# Altium project G030-T12_v2.PrjPcb
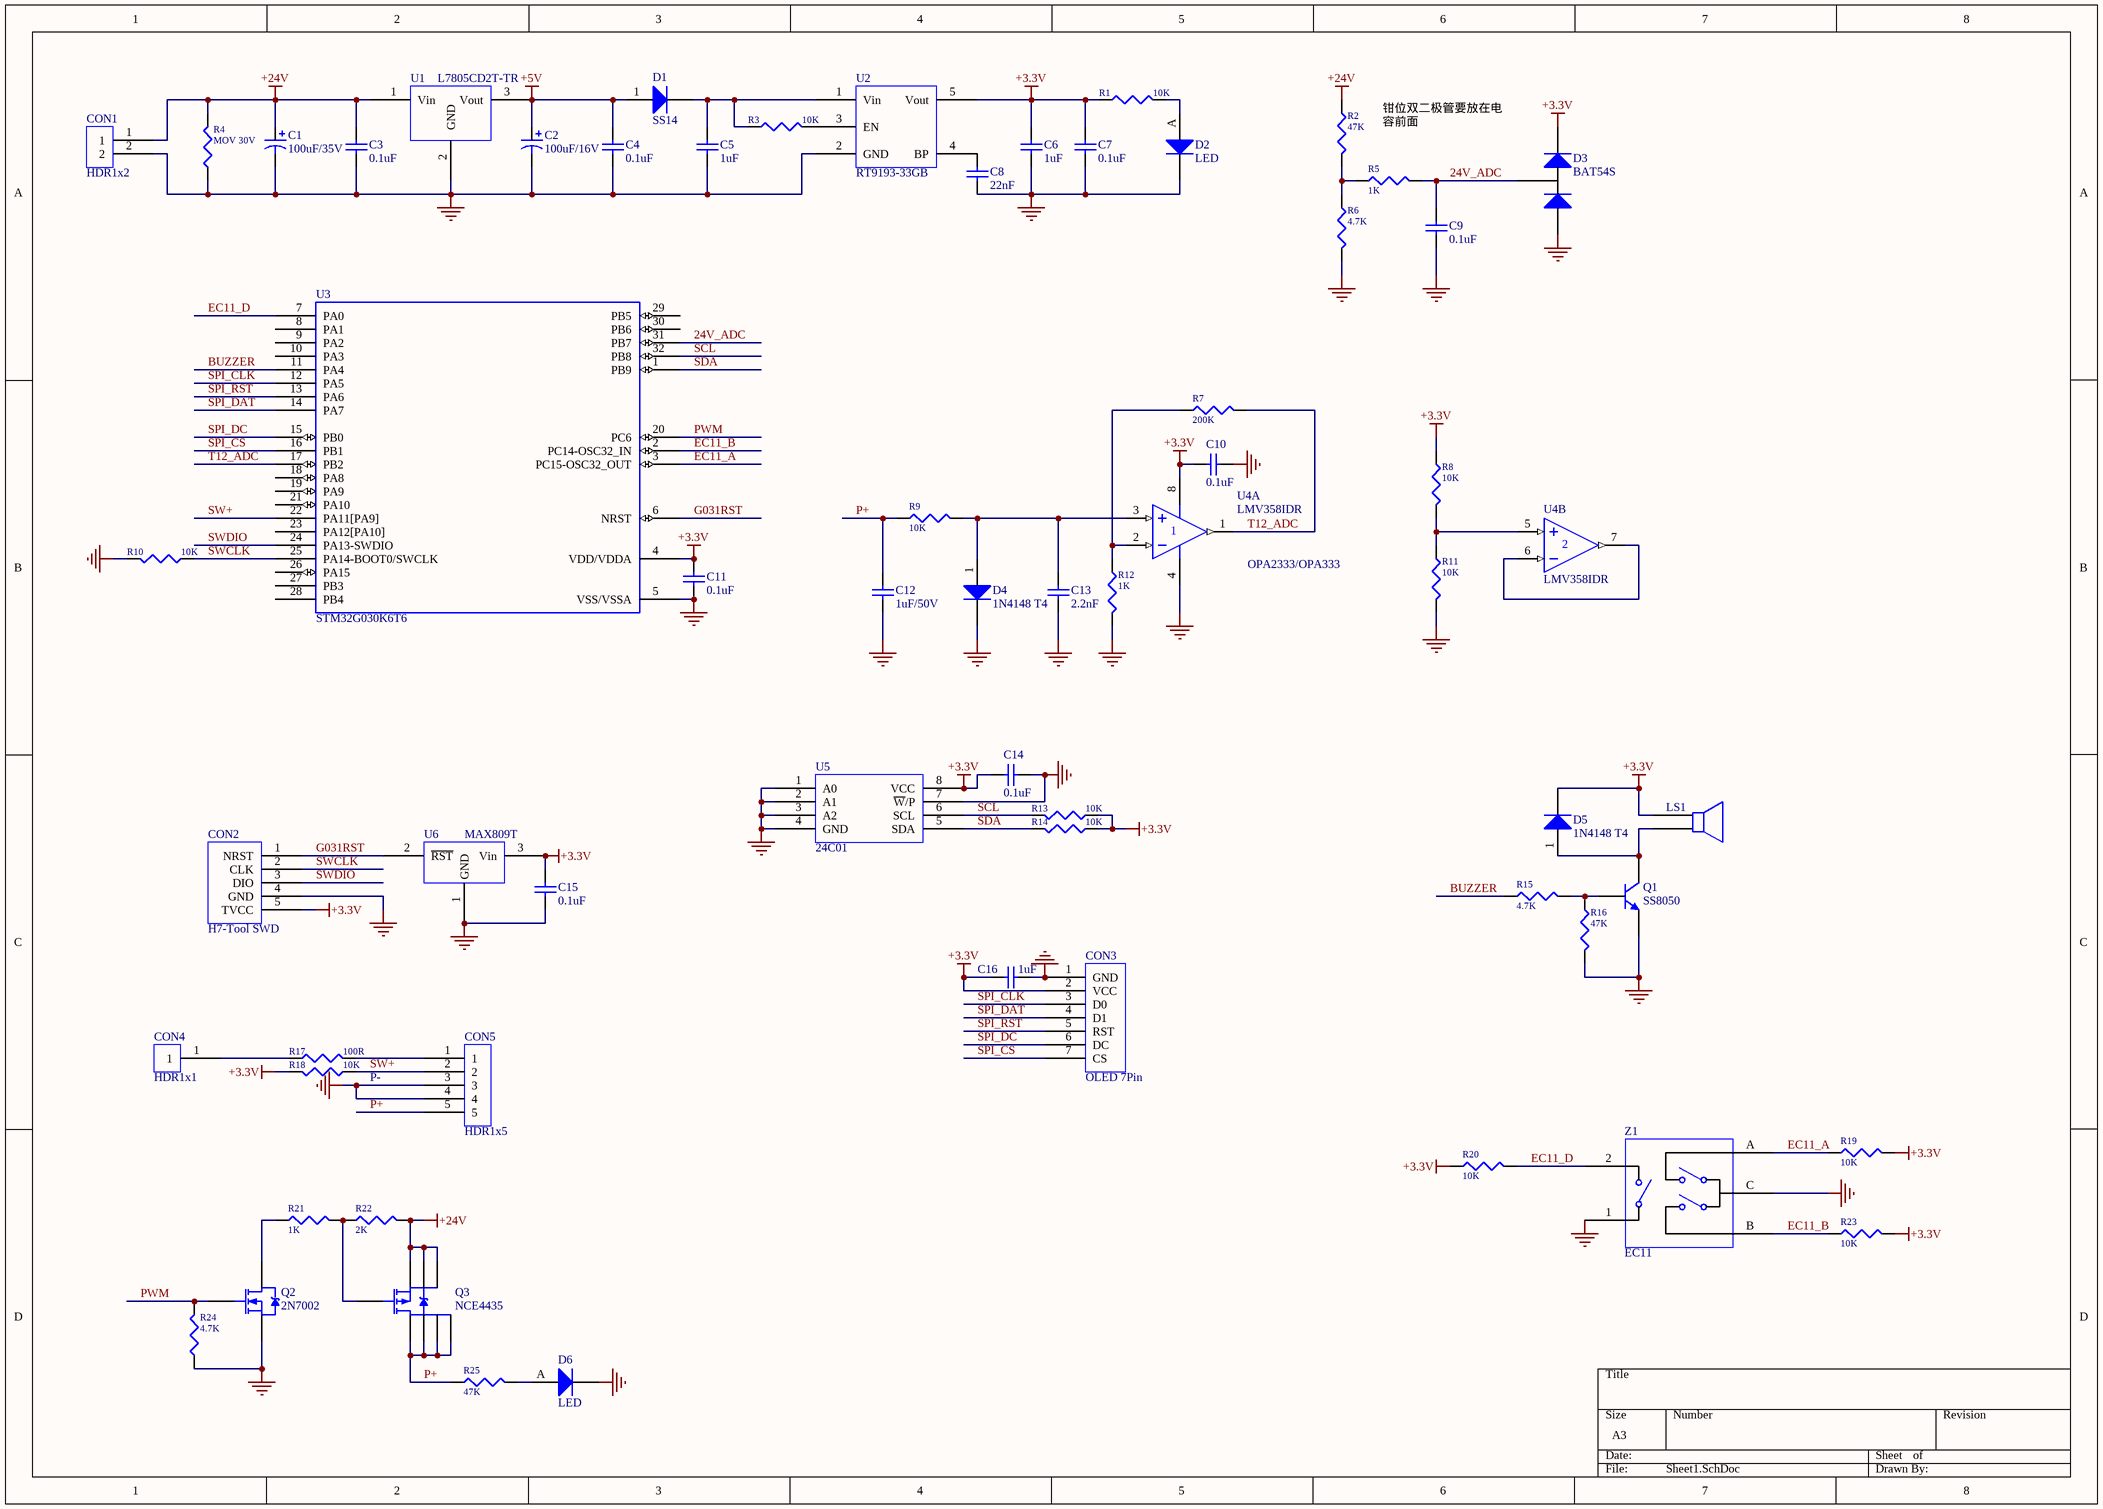
[diagram p0: Sheet1.SchDoc]
1 sheet, 63 parts. Net scope: global (net labels, ports and power ports of the same name join across sheets).
Board file: PCB1.PcbDoc

## Sheet Sheet1.SchDoc
size A3; SheetNumber: 1; SheetTotal: 1

### Parts
C1  value 100uF/35V  [CAP-SMD_BD6.3-L6.6-W6.6-FD]  (hidden comment: Cap Pol1)
C2  value 100uF/16V  [CAP-SMD_BD6.3-L6.6-W6.6-FD]  (hidden comment: Cap Pol1)
C3  0.1uF  [0603_C]
C4  0.1uF  [0603_C]
C5  1uF  [0603_C]
C6  1uF  [0603_C]
C7  0.1uF  [0603_C]
C8  22nF  [0603_C]
C9  0.1uF  [0603_C]
C10  0.1uF  [0603_C]
C11  0.1uF  [0603_C]
C12  1uF/50V  [0603_C]
C13  2.2nF  [0603_C]
C14  0.1uF  [0603_C]
C15  0.1uF  [0603_C]
C16  1uF  [0603_C]
CON1  HDR1x2  [HDR2.54-LI-2p]
CON2  H7-Tool SWD  [hdr1x5]
CON3  OLED 7Pin  [0.96 OLED SPI]
CON4  HDR1x1  [HDR2.54-LI-1P]
CON5  HDR1x5  [T12_SOCKET]
D1  SS14  [SMA(DO-214AC)_S1]
D2  LED  [0603_LED_S1]
D3  BAT54S  [SOT-23(SOT-23-3)]
D4  1N4148 T4  [SOD-123_MARK]
D5  1N4148 T4  [SOD-123_MARK]
D6  LED  [0603_LED_S1]
LS1  GSC8525RA-16R2700  [BUZ-SMD_L5.0-W5.5-P4.60]  (value not drawn)
Q1  SS8050  [SOT-23(SOT-23-3)]
Q2  2N7002  [SOT-23(SOT-23-3)]
Q3  NCE4435  [SOP-8_150mil]
R1  10K  [0603_R]
R2  47K  [0603_R]
R3  10K  [0603_R]
R4  MOV 30V  [0805_R]
R5  1K  [0603_R]
R6  4.7K  [0603_R]
R7  200K  [0603_R]
R8  10K  [0603_R]
R9  10K  [0603_R]
R10  10K  [0603_R]
R11  10K  [0603_R]
R12  1K  [0603_R]
R13  10K  [0603_R]
R14  10K  [0603_R]
R15  4.7K  [0603_R]
R16  47K  [0603_R]
R17  100R  [1206_R]
R18  10K  [0603_R]
R19  10K  [0603_R]
R20  10K  [0603_R]
R21  1K  [0603_R]
R22  2K  [0603_R]
R23  10K  [0603_R]
R24  4.7K  [0603_R]
R25  47K  [0603_R]
U1  L7805CD2T-TR  [TO-263-2]
U2  RT9193-33GB  [SOT-23-5]
U3  STM32G030K6T6  [LQFP-32_7x7x08P]
U4  LMV358IDR  [SOP-8_150mil]  (parts A,B of 2)
U5  24C01  [SOP-8_150mil]
U6  MAX809T  [SOT-23(SOT-23-3)]
Z1  EC11  [EC11-B]

### Nets
+3.3V: C6.2 C7.2 C10.1 C11.2 C14.2 C15.1 C16.1 CON2.5(TVCC) CON3.2(VCC) D3.2 D5.2(K) LS1.1 R1.2(BOT) R8.1(TOP) R13.1(TOP) R14.1(TOP) R18.2(BOT) R19.2(BOT) R20.1(TOP) R23.2(BOT) U2.5(Vout) U3.4(VDD/VDDA) U4.8 U5.8(VCC) U6.3(Vin)
+5V: C2.1 C4.2 D1.1(A) U1.3(Vout)
+24V: C1.1 C3.2 CON1.1 Q3.1(S) Q3.2(S) Q3.3(S) R2.1(TOP) R4.1(TOP) R22.2(BOT) U1.1(Vin)
GND: C1.2 C2.2 C3.1 C4.1 C5.1 C6.1 C7.1 C8.1 C9.1 C10.2 C11.1 C12.1 C13.1 C14.1 C15.2 C16.2 CON1.2 CON2.4(GND) CON3.1(GND) CON5.3 CON5.4 D2.K D3.1 D4.2(K) D6.K Q1.2(E) Q2.2(S) R4.2(BOT) R6.2(BOT) R10.2(BOT) R11.2(BOT) R12.2(BOT) R16.2(BOT) R24.1(TOP) U1.2(GND) U2.2(GND) U3.5(VSS/VSSA) U4.4 U5.1(A0) U5.2(A1) U5.3(A2) U5.4(GND) U5.7(~{W}/P) U6.1(GND) Z1.1(E) Z1.C
24V_ADC: C9.2 D3.3 R5.2(BOT) U3.31(PB7)
BUZZER: R15.1(TOP) U3.11(PA4)
EC11_A: R19.1(TOP) U3.3(PC15-OSC32_OUT) Z1.A
EC11_B: R23.1(TOP) U3.2(PC14-OSC32_IN) Z1.B
EC11_D: R20.2(BOT) U3.7(PA0) Z1.2(D)
G031RST: CON2.1(NRST) U3.6(NRST) U6.2(~{RST})
P+: C12.2 CON5.5 Q3.5(D) Q3.6(D) Q3.7(D) Q3.8(D) R9.1(TOP) R25.2(BOT)
PWM: Q2.1(G) R24.2(BOT) U3.20(PC6)
SCL: R13.2(BOT) U3.32(PB8) U5.6(SCL)
SDA: R14.2(BOT) U3.1(PB9) U5.5(SDA)
SPI_CLK: CON3.3(D0) U3.12(PA5)
SPI_CS: CON3.7(CS) U3.16(PB1)
SPI_DAT: CON3.4(D1) U3.14(PA7)
SPI_DC: CON3.6(DC) U3.15(PB0)
SPI_RST: CON3.5(RST) U3.13(PA6)
SW+: CON5.2 R18.1(TOP) U3.22(PA11[PA9])
SWCLK: CON2.2(CLK) R10.1(TOP) U3.25(PA14-BOOT0/SWCLK)
SWDIO: CON2.3(DIO) U3.24(PA13-SWDIO)
T12_ADC: R7.2(BOT) U3.17(PB2) U4.1(OUT)
NetC5_2: C5.2 D1.2(K) R3.2(BOT) U2.1(Vin)
NetC8_2: C8.2 U2.4(BP)
NetC13_2: C13.2 D4.1(A) R9.2(BOT) U4.3(IN+)
NetCON4_1: CON4.1 R17.1(TOP)
NetCON5_1: CON5.1 R17.2(BOT)
NetD2_A: D2.A R1.1(TOP)
NetD5_1: D5.1(A) LS1.2 Q1.3(C)
NetD6_A: D6.A R25.1(TOP)
NetQ1_1: Q1.1(B) R15.2(BOT) R16.1(TOP)
NetQ2_3: Q2.3(D) R21.1(TOP)
NetQ3_4: Q3.4(G) R21.2(BOT) R22.1(TOP)
NetR2_2: R2.2(BOT) R5.1(TOP) R6.1(TOP)
NetR3_1: R3.1(TOP) U2.3(EN)
NetR7_1: R7.1(TOP) R12.1(TOP) U4.2(IN-)
NetR8_2: R8.2(BOT) R11.1(TOP) U4.5(IN+)
NetU4_6: U4.6(IN-) U4.7(OUT)

Not connected (* = marked no-connect by the designer): U3 8(PA1) 9(PA2) 10(PA3) 18(PA8) 19(PA9) 21(PA10) 23(PA12[PA10]) 26(PA15) 27(PB3) 28(PB4) 29(PB5) 30(PB6)

### Notes on the sheet
- 钳位双二极管要放在电容前面
- (near U4) OPA2333/OPA333
- P-

### Library data of the parts
C1 C2 = Cap Pol1: Polarized Capacitor (Radial); Published: 8-Jun-2000; LatestRevisionDate: 17-Jul-2002; LatestRevisionNote: Re-released for DXP Platform.; PackageReference: RB7.6-15; Publisher: Altium Limited; PackageDescription: Polarized Capacitor (Radial); 2 Leads
C3-C16 = 0603 100nF (104) 10% 50V: 贴片电容; ComponentLink1Description: 供应商链接; ComponentLink1URL: http://www.szlcsc.com/product/details_15331.html; Package: 0603; Supplier: LC; SuppliersPartNumber: C14663
D1 D2 D4-D6 = Diode: 二极管; Notepad: 1N4007 4007 编号C2464 已经停售, 使用新物料编号C95872; ComponentLink1Description: 供应商链接; ComponentLink1URL: http://www.szlcsc.com/product/details_2841.html; Package: SMA(DO-214AC); Supplier: LC; SuppliersPartNumber: C95872
D3 = BAT54S: 二极管
LS1 = SPEAKER: Manufacturer: INGHAi; PCB Footprint: BUZ-SMD_GSC85; Propety: 蜂鸣器; Para: 85dB @ 3V, 10cm; JLC_CODE: C255314; PartNumber: GSC8525RA-16R2700
Q1 = SS8050: NPN General Purpose Amplifier
Q2 = AO3416: N-Channel Power MOSFET; Note: Pin 4 not drawn and electrically connected to Pin 2.; Published: 8-Jun-2000; LatestRevisionDate: 17-Jul-2002; LatestRevisionNote: Re-released for DXP Platform.; DatasheetVersion: PD-9.390D; PackageVersion: Feb-1997; PackageReference: TO-220AB; Publisher: Altium Limited; PackageDescription: TO, Thru-Hole, Vertical, Heatsink Mounted; 3 In-Line Leads; Pitch 2.54 mm; ComponentLink1Description: Manufacturer Link; ComponentLink1URL: http://www.irf.com/
Q3 = TPC8107: P-CH, 30V -13A 5.5mR
R1-R25 = RES: Resistor
U1 = 78M05
U3 = STM32G030K6T6: No Description Available; Mfr_Name: STMicroelectronics; RefDes: RefDes; Type: Type
U4 = LM358: 通用运放; ComponentLink1Description: 供应商链接; ComponentLink1URL: http://www.szlcsc.com/product/details_8427.html; Package: SOIC-8; Supplier: LC; SuppliersPartNumber: C7950
U5 = 24LC64
U6 = MAX809T: 3.08v